# EAGLE schematic SenseGrain v0.1 (EAGLE 7.2.0)
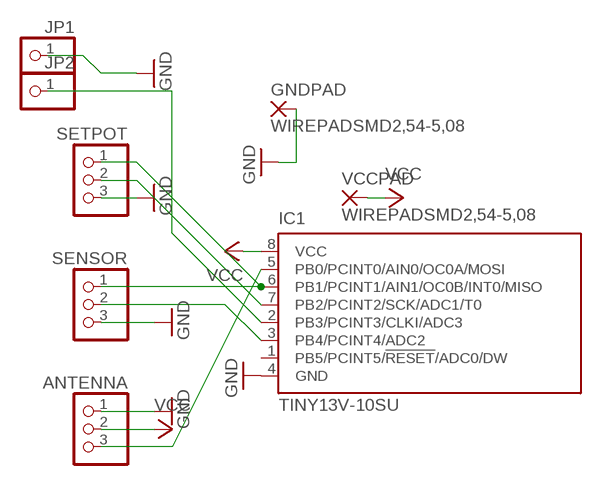
[diagram p0: schematic, sheet 1]

## Parts
ANTENNA  PINHD-1X3CB  [1X03-CLEANBIG]
GNDPAD  WIREPADSMD2,54-5,08  [SMD2,54-5,08]
IC1  TINY13V-10SU  [8S2]
JP1  PINHD-1X1  [1X01]
JP2  PINHD-1X1  [1X01]
SENSOR  PINHD-1X3CB  [1X03-CLEANBIG]
SETPOT  PINHD-1X3CB  [1X03-CLEANBIG]
VCCPAD  WIREPADSMD2,54-5,08  [SMD2,54-5,08]

## Nets
GND: ANTENNA.1 GNDPAD.1(P) IC1.4(GND) JP1.1 SENSOR.3 SETPOT.3
N$1: IC1.6(PB1/PCINT1/AIN1/OC0B/INT0/MISO) SENSOR.1 SETPOT.1
N$2: ANTENNA.3 IC1.5(PB0/PCINT0/AIN0/OC0A/MOSI)
N$4: IC1.3(PB4/PCINT4/ADC2) SENSOR.2
N$5: IC1.7(PB2/PCINT2/SCK/ADC1/T0) SETPOT.2
N$6: IC1.2(PB3/PCINT3/CLKI/ADC3) JP2.1
VCC: ANTENNA.2 IC1.8(VCC) VCCPAD.1(P)
Unconnected: IC1.1(PB5/PCINT5/!RESET!/ADC0/DW)

## Library data of the parts
ANTENNA SENSOR SETPOT = adafruit:PINHD-1X3: PIN HEADER
GNDPAD VCCPAD = wirepad:WIREPAD: Wire PAD connect wire on PCB
IC1 = atmel:TINY13: 8-bit AVR Microcontroller with 1K Bytes In-System Programmable Flash Source: http://www.atmel.com/dyn/resources/prod_documents/2535S.pdf; MPN: ATTINY13V-10SU; OC_FARNELL: 9171584; OC_NEWARK: 96K6524
JP1 JP2 = pinhead:PINHD-1X1: PIN HEADER

## Net classes
0 default: width 0.254 mm, drill 0.508 mm, clearance 0.305 mm